# EAGLE schematic Con_Raspi (EAGLE 6.4)
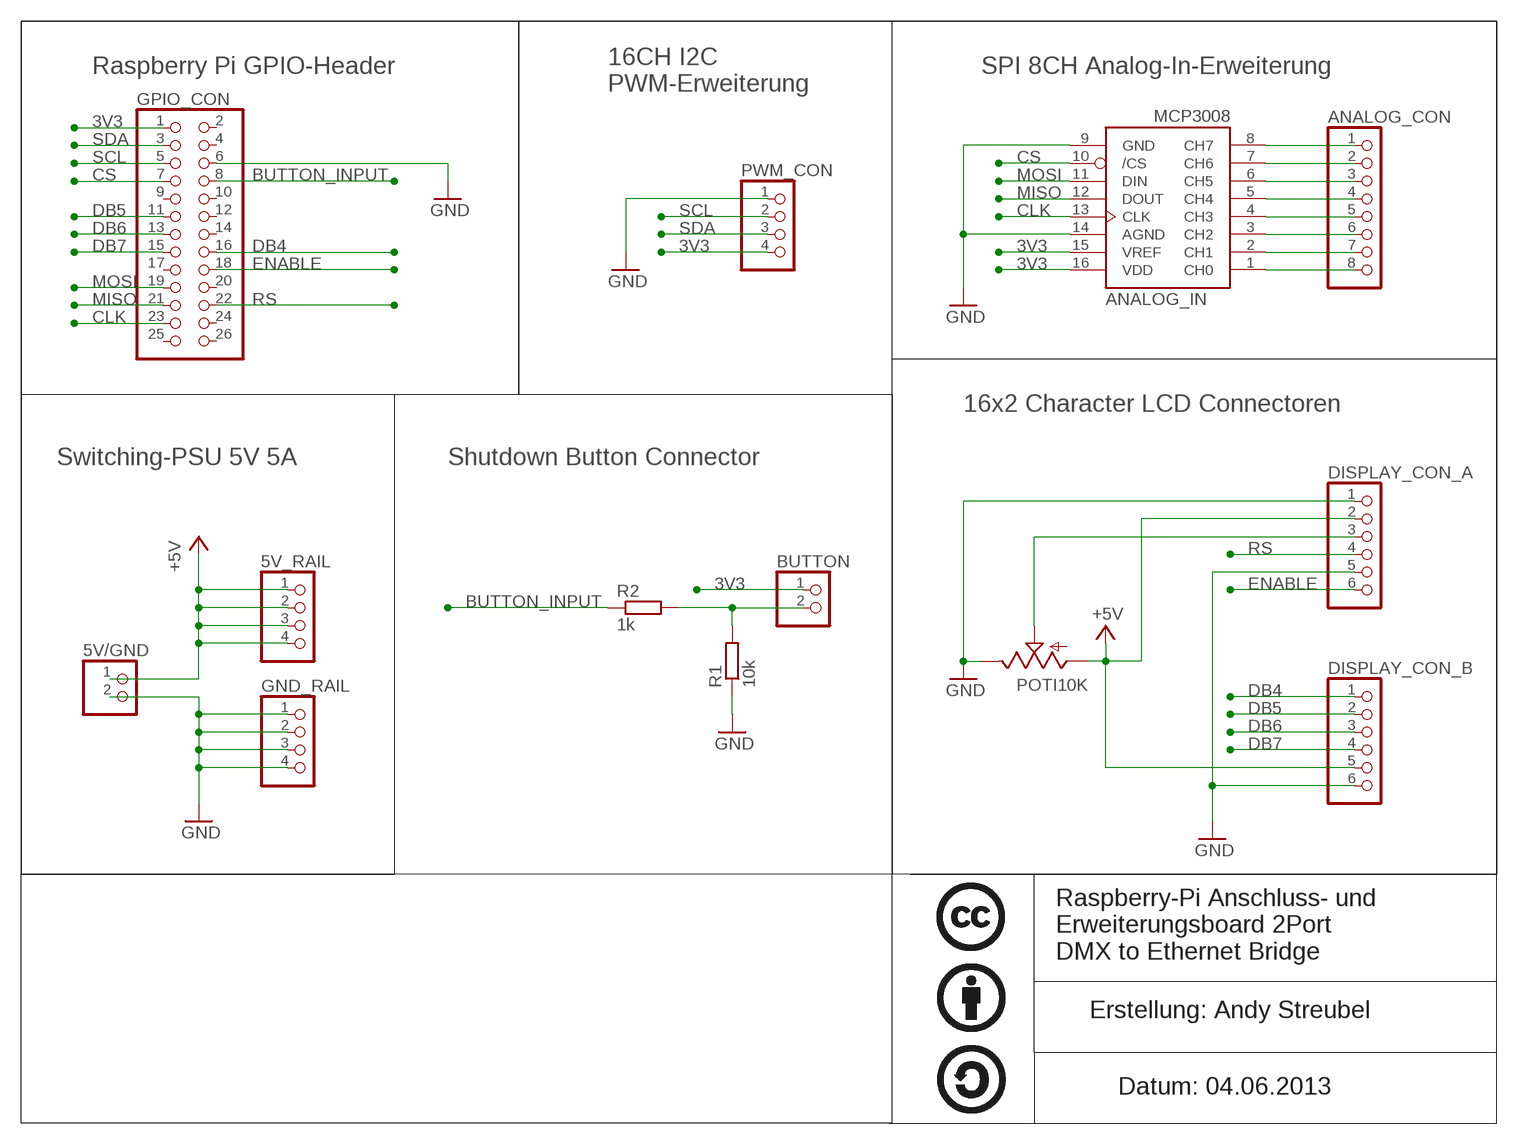
[diagram p0: schematic, sheet 1]

## Parts
5V/GND  PINHD-1X2  [1X02]
5V_RAIL  PINHD-1X4  [1X04]
ANALOG_CON  PINHD-1X8  [1X08]
ANALOG_IN  MCP3008  [DIL16]
BUTTON  PINHD-1X2  [1X02]
DISPLAY_CON_A  PINHD-1X6  [1X06]
DISPLAY_CON_B  PINHD-1X6  [1X06]
GND_RAIL  PINHD-1X4  [1X04]
GPIO_CON  PINHD-2X13  [2X13]
POTI10K  TRIM  [6MM]
PWM_CON  PINHD-1X4  [1X04]
R1  10k  R-EU_0207/7  [0207/7]
R2  1k  R-EU_0207/7  [0207/7]

## Nets
3V3: ANALOG_IN.15(VREF) ANALOG_IN.16(VDD) BUTTON.1 GPIO_CON.1 PWM_CON.4
+5V: 5V/GND.1 5V_RAIL.1 5V_RAIL.2 5V_RAIL.3 5V_RAIL.4 DISPLAY_CON_A.2 DISPLAY_CON_B.5 POTI10K.A
BUTTON_INPUT: GPIO_CON.8 R2.1
CLK: ANALOG_IN.13(CLK) GPIO_CON.23
CS: ANALOG_IN.10(/CS) GPIO_CON.7
DB4: DISPLAY_CON_B.1 GPIO_CON.16
DB5: DISPLAY_CON_B.2 GPIO_CON.11
DB6: DISPLAY_CON_B.3 GPIO_CON.13
DB7: DISPLAY_CON_B.4 GPIO_CON.15
ENABLE: DISPLAY_CON_A.6 GPIO_CON.18
GND: 5V/GND.2 ANALOG_IN.9(GND) ANALOG_IN.14(AGND) DISPLAY_CON_A.1 DISPLAY_CON_A.5 DISPLAY_CON_B.6 GND_RAIL.1 GND_RAIL.2 GND_RAIL.3 GND_RAIL.4 GPIO_CON.6 POTI10K.E PWM_CON.1 R1.1
MISO: ANALOG_IN.12(DOUT) GPIO_CON.21
MOSI: ANALOG_IN.11(DIN) GPIO_CON.19
N$1: ANALOG_CON.1 ANALOG_IN.8(CH7)
N$2: ANALOG_CON.2 ANALOG_IN.7(CH6)
N$3: ANALOG_CON.3 ANALOG_IN.6(CH5)
N$4: ANALOG_CON.4 ANALOG_IN.5(CH4)
N$5: ANALOG_CON.5 ANALOG_IN.4(CH3)
N$6: ANALOG_CON.6 ANALOG_IN.3(CH2)
N$7: ANALOG_CON.7 ANALOG_IN.2(CH1)
N$8: ANALOG_CON.8 ANALOG_IN.1(CH0)
N$9: DISPLAY_CON_A.3 POTI10K.S
N$12: BUTTON.2 R1.2 R2.2
RS: DISPLAY_CON_A.4 GPIO_CON.22
SCL: GPIO_CON.5 PWM_CON.2
SDA: GPIO_CON.3 PWM_CON.3
Unconnected: GPIO_CON.2 GPIO_CON.4 GPIO_CON.9 GPIO_CON.10 GPIO_CON.12 GPIO_CON.14 GPIO_CON.17 GPIO_CON.20 GPIO_CON.24 GPIO_CON.25 GPIO_CON.26

## Notes on the sheet
- Raspberry Pi GPIO-Header | SPI 8CH Analog-In-Erweiterung
- 16CH I2C 
  PWM-Erweiterung
- 16x2 Character LCD Connectoren
- Switching-PSU 5V 5A | Shutdown Button Connector
- Raspberry-Pi Anschluss- und
  Erweiterungsboard 2Port
  DMX to Ethernet Bridge
- Erstellung: Andy Streubel
- /media/CA222A25222A16CB/Users/Andy/Downloads/Creative Commons/cc.large.bmp
- Datum: 04.06.2013
- /media/CA222A25222A16CB/Users/Andy/Downloads/Creative Commons/sa.large.bmp

## Library data of the parts
5V/GND BUTTON = pinhead:PINHD-1X2: PIN HEADER
5V_RAIL GND_RAIL PWM_CON = pinhead:PINHD-1X4: PIN HEADER
ANALOG_CON = pinhead:PINHD-1X8: PIN HEADER
ANALOG_IN = adafruit:MCP3008
DISPLAY_CON_A DISPLAY_CON_B = pinhead:PINHD-1X6: PIN HEADER
GPIO_CON = pinhead:PINHD-2X13: PIN HEADER
POTI10K = adafruit:TRIM
R1 R2 = rcl:R-EU_: RESISTOR, European symbol